# Altium schematic sheet Schematic.SchDoc
size A; SheetNumber: 1; SheetTotal: 1
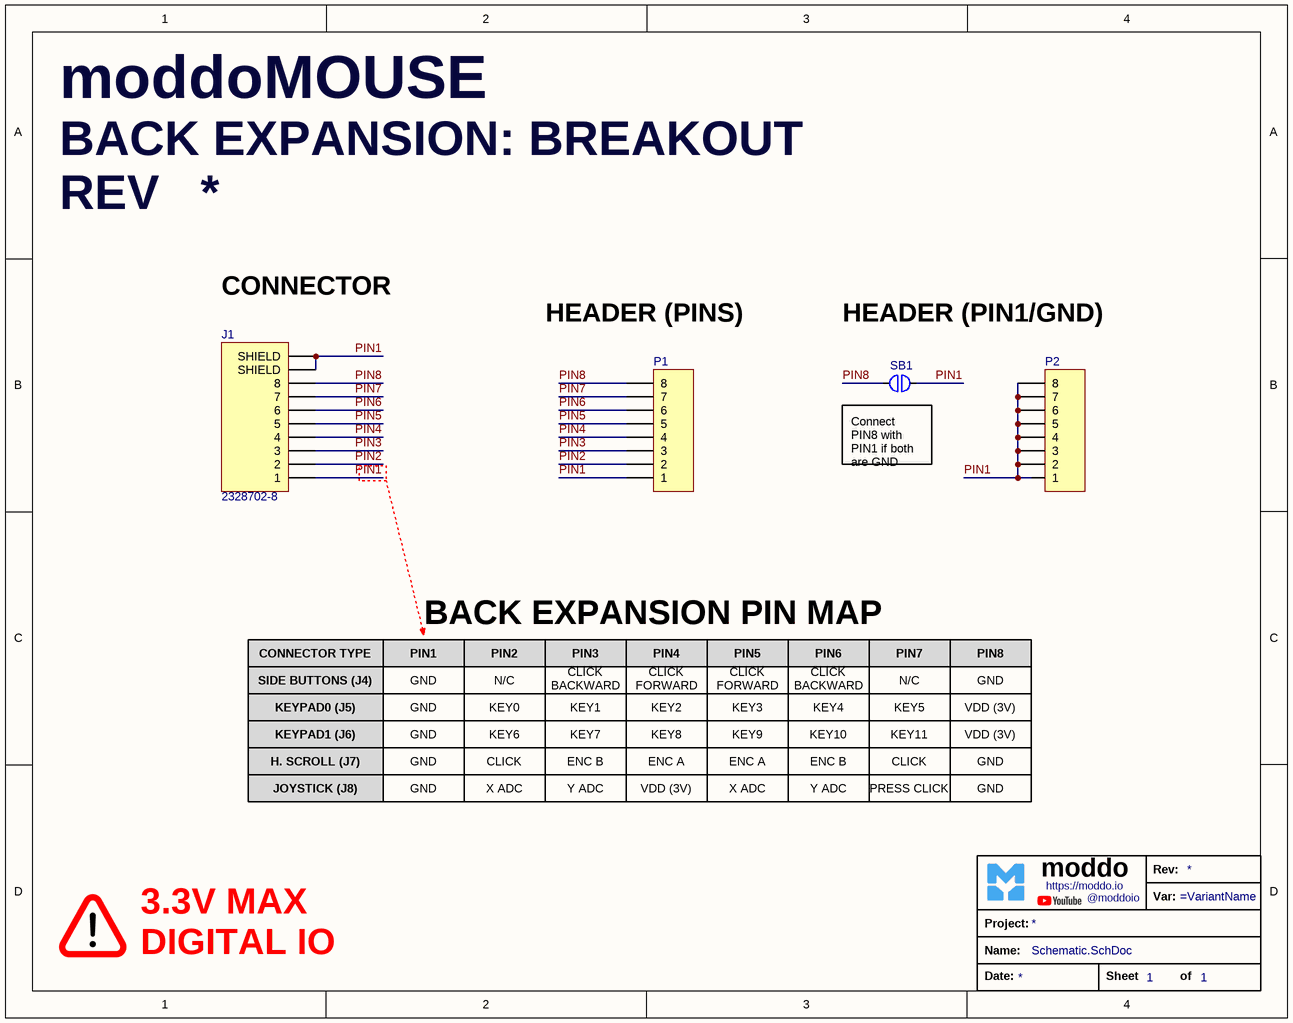
[diagram p0: Schematic.SchDoc]

## Parts
?  TitleBlock_moddo  (value not drawn)  (graphical)
J1  2328702-8  [2328702-8]
P1  Header 8  [HDR1X8]  (value not drawn)
P2  Header 8  [HDR1X8]  (value not drawn)
SB1  Solderbridge  [Solderbridge]  (value not drawn)  (no BOM)

## Nets
PIN1: J1.1 J1.S1(SHIELD) J1.S2(SHIELD) P1.1 P2.1 P2.2 P2.3 P2.4 P2.5 P2.6 P2.7 P2.8 SB1.1
PIN2: J1.2 P1.2
PIN3: J1.3 P1.3
PIN4: J1.4 P1.4
PIN5: J1.5 P1.5
PIN6: J1.6 P1.6
PIN7: J1.7 P1.7
PIN8: J1.8 P1.8 SB1.2

## Notes on the sheet
- moddoMOUSE <https://moddo.io/>
- BACK EXPANSION: BREAKOUT <https://moddo.io/>
- REV
- CONNECTOR
- HEADER (PINS)
- HEADER (PIN1/GND)
- (near SB1) Connect PIN8 with PIN1 if both are GND
- BACK EXPANSION PIN MAP
- CONNECTOR TYPE
- KEYPAD0 (J5)
- SIDE BUTTONS (J4)
- PIN1
- GND
- PIN2
- KEY0
- N/C
- PIN3
- KEY1
- CLICK
- BACKWARD
- PIN4
- KEY2
- FORWARD
- PIN5
- KEY3
- PIN6
- KEY4
- PIN7
- KEY5
- PIN8
- VDD (3V)
- KEYPAD1 (J6)
- H. SCROLL (J7)
- KEY6
- KEY7
- ENC B
- KEY8
- ENC A
- KEY9
- KEY10
- KEY11
- JOYSTICK (J8)
- X ADC
- Y ADC
- PRESS CLICK
- 3.3V MAX
- DIGITAL IO
- (in symbol TitleBlock_moddo) Rev:; moddo; https://moddo.io; Var:; @moddoio; Project:; Name:; Date:; Sheet; of

## Library data of the parts
J1 = 2328702-8: FFC/FPC Connector, 8 Contact(s), 1 Row(s), Right Angle, Solder Terminal, Natural Insulator; Manufacturer: TE Connectivity; Actuator Material: Thermoplastic; Actuator Color: Black; Plating: Gold; Number of Positions: 8; Voltage Rating: 50V; Connector System: Wire-to-Board; Gender: Receptacle; Sealable: No (Without); Supplier 1: Arrow Electronics; Manufacturer Part Number: 2328702-8; RoHS: Yes; Category: FFC / FPC; Stock 1: 56000; Pricing 1: 28000=0.0961 (USD); Mounting Technology: Surface Mount; Contact Material: Copper Alloy; Contact Plating: Gold; Housing Material: Thermoplastic; Housing Color: Natural; Min Operating Temperature: -40°C; Max Operating Temperature: 85°C; Packaging: Cut Tape; Termination: Solder; Series: -; Number of Contacts: 8; Number of Rows: 1; Operating Supply Voltage: 50V; Orientation: Right Angle; Length: 6mm; Height: 1mm; Flammability Rating: UL94 V-0; ComponentLink1URL: https://www.te.com/commerce/DocumentDelivery/DDEController?Action=srchrtrv&amp;DocNm=2328702&amp;DocType=Customer+Drawing&amp;DocLang=English&src-supplier=Digikey; ComponentLink1Description: https://www.te.com/commerce/DocumentDelivery/DDEController?Action=srchrtrv&amp;DocNm=2328702&amp;DocType=Customer+Drawing&amp;DocLang=English&src-supplier=Digikey; Supplier Part Number 1: 2328702-8
P1 P2 = Header 8: Header, 8-Pin; LatestRevisionDate: 17-Jul-2002; LatestRevisionNote: Re-released for DXP Platform.; Publisher: Altium Limited; Manufacturer: N/A; Manufacturer Part Number: N/A
SB1 = SOLDERBRIDGE: Artikkelnr Noca: N.A.; Part Number: Solderbridge; Manufacturer: *; Manufacturer Part Number: *; Datasheet: *; LatestRevisionDate: 2009-12-14; Pin Count: 2; Publisher: Nordic Semiconductor; Published: 2009-12-14; Value: Solderbridge; Note: *; Supplier: *; Supplier part number: *; 2nd source Supplier: *; 2nd source part number: *; Footprint Doc: Solderbridge; Artikkelnr Simpro: N.A.